# EAGLE design inhaler (EAGLE 9.6.2)
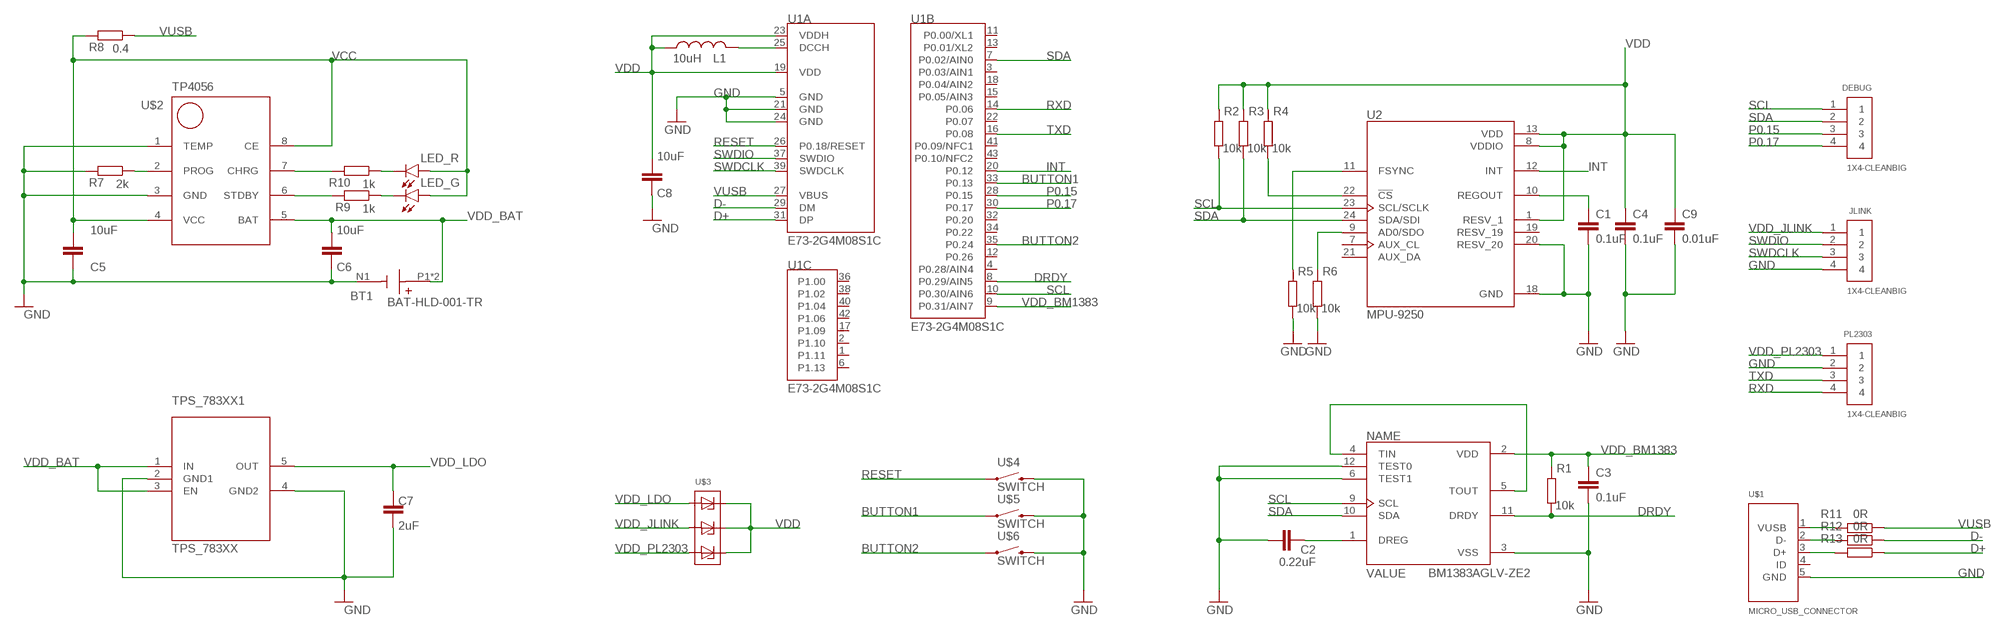
[diagram p0: schematic, sheet 1]

## Parts
BT1  BAT-HLD-001-TR  [BAT_BAT-HLD-001-TR]
C1  0.1uF  C-EUC0805  [C0805]
C2  0.22uF  C-EUC0805  [C0805]
C3  0.1uF  C-EUC0805  [C0805]
C4  0.1uF  C-EUC0805  [C0805]
C5  10uF  C-EUC0805  [C0805]
C6  10uF  C-EUC0805  [C0805]
C7  2uF  C-EUC0805  [C0805]
C8  10uF  C-EUC0805  [C0805]
C9  0.01uF  C-EUC0805  [C0805]
DEBUG  1X4-CLEANBIG  [1X04-CLEANBIG]
JLINK  1X4-CLEANBIG  [1X04-CLEANBIG]
L1  10uH  L-USL0805  [L0805]
LED_G  LEDSMT1206  [1206]
LED_R  LEDSMT1206  [1206]
PL2303  1X4-CLEANBIG  [1X04-CLEANBIG]
R1  10k  R-EU_R0805  [R0805]
R2  10k  R-EU_R0805  [R0805]
R3  10k  R-EU_R0805  [R0805]
R4  10k  R-EU_R0805  [R0805]
R5  10k  R-EU_R0805  [R0805]
R6  10k  R-EU_R0805  [R0805]
R7  2k  R-EU_R0805  [R0805]
R8  0.4  R-EU_R0805  [R0805]
R9  1k  R-EU_R0805  [R0805]
R10  1k  R-EU_R0805  [R0805]
R11  0R  R-EU_R0805  [R0805]
R12  0R  R-EU_R0805  [R0805]
R13  0R  R-EU_R0805  [R0805]
TPS_783XX1  TPS_783XX  [SOT65P280X145-5N]
U1  E73-2G4M08S1C  [E73-2G4M08S1C]
U2  MPU-9250  [QFN40P300X300X105-24N]
U3  BM1383AGLV-ZE2  [PQFN55P250X250X100-12N]
U$1  MICRO_USB_CONNECTOR  [MICRO_USB_4LEGS]
U$2  TP4056  [SOP8]
U$3  SD103ATW  [SOT363]
U$4  SWITCH  [SWITCH_2PIN]
U$5  SWITCH  [SWITCH_2PIN]
U$6  SWITCH  [SWITCH_2PIN]

## Nets
BUTTON1: U1.33(B:P0.13) U$5.1
BUTTON2: U1.35(B:P0.24) U$6.1
D+: R13.1 U1.31(A:DP)
D-: R12.1 U1.29(A:DM)
DRDY: R1.1 U1.8(B:P0.29/AIN5) U3.11(DRDY)
GND: BT1.N1(-) C1.2 C2.1 C3.2 C4.2 C5.1 C6.1 C7.1 C8.1 C9.2 JLINK.4 PL2303.2 R5.1 R6.1 R7.2 TPS_783XX1.2(GND1) TPS_783XX1.4(GND2) U1.5(A:GND) U1.21(A:GND) U1.24(A:GND) U2.18(GND) U2.20(RESV_20) U3.3(VSS) U3.6(TEST1) U3.12(TEST0) U$1.5(GND) U$2.1(TEMP) U$2.3(GND) U$4.2 U$5.2 U$6.2
INT: U1.20(B:P0.12) U2.12(INT)
N$1: C1.1 U2.10(REGOUT)
N$2: U3.4(TIN) U3.5(TOUT)
N$3: C2.2 U3.1(DREG)
N$4: R4.1 U2.22(!CS)
N$5: R5.2 U2.11(FSYNC)
N$6: R7.1 U$2.2(PROG)
N$7: R6.2 U2.9(AD0/SDO)
N$8: R10.2 U$2.7(CHRG)
N$9: L1.2 U1.25(A:DCCH)
N$10: R9.2 U$2.6(STDBY)
N$11: LED_R.C R10.1
N$12: LED_G.C R9.1
N$13: R13.2 U$1.3(D+)
N$14: R11.2 U$1.1(VUSB)
N$15: R12.2 U$1.2(D-)
P0.15: DEBUG.3 U1.28(B:P0.15)
P0.17: DEBUG.4 U1.30(B:P0.17)
RESET: U1.26(A:P0.18/RESET) U$4.1
RXD: PL2303.4 U1.14(B:P0.06)
SCL: DEBUG.1 R2.1 U1.10(B:P0.30/AIN6) U2.23(SCL/SCLK) U3.9(SCL)
SDA: DEBUG.2 R3.1 U1.7(B:P0.02/AIN0) U2.24(SDA/SDI) U3.10(SDA)
SWDCLK: JLINK.3 U1.39(A:SWDCLK)
SWDIO: JLINK.2 U1.37(A:SWDIO)
TXD: PL2303.3 U1.16(B:P0.08)
VCC: C5.2 LED_G.A LED_R.A R8.2 U$2.4(VCC) U$2.8(CE)
VDD: C4.1 C8.2 C9.1 L1.1 R2.2 R3.2 R4.2 U1.19(A:VDD) U1.23(A:VDDH) U2.1(RESV_1) U2.8(VDDIO) U2.13(VDD) U$3.2 U$3.4 U$3.6
VDD_BAT: BT1.P1(+) BT1.P2(+) C6.2 TPS_783XX1.1(IN) TPS_783XX1.3(EN) U$2.5(BAT)
VDD_BM1383: C3.1 R1.2 U1.9(B:P0.31/AIN7) U3.2(VDD)
VDD_JLINK: JLINK.1 U$3.3
VDD_LDO: C7.2 TPS_783XX1.5(OUT) U$3.1
VDD_PL2303: PL2303.1 U$3.5
VUSB: R8.1 R11.1 U1.27(A:VBUS)
Unconnected: U1.1(C:P1.11) U1.2(C:P1.10) U1.3(B:P0.03/AIN1) U1.4(B:P0.28/AIN4) U1.6(C:P1.13) U1.11(B:P0.00/XL1) U1.12(B:P0.26) U1.13(B:P0.01/XL2) U1.15(B:P0.05/AIN3) U1.17(C:P1.09) U1.18(B:P0.04/AIN2) U1.22(B:P0.07) U1.32(B:P0.20) U1.34(B:P0.22) U1.36(C:P1.00) U1.38(C:P1.02) U1.40(C:P1.04) U1.41(B:P0.09/NFC1) U1.42(C:P1.06) U1.43(B:P0.10/NFC2) U2.7(AUX_CL) U2.19(RESV_19) U2.21(AUX_DA) U$1.4(ID)

## Library data of the parts
BT1 = BAT-HLD-001-TR:BAT-HLD-001-TR: Battery Retainer Coin, 20.0mm 1 Cell SMD (SMT) Tab Check availability <https://pricing.snapeda.com/parts/BAT-HLD-001-TR/Linx/view-part?ref=eda>; AVAILABILITY: In Stock; DESCRIPTION: Battery Retainer Coin, 20.0mm 1 Cell SMD (SMT) Tab; MF: Linx; MP: BAT-HLD-001-TR; PACKAGE: None; PRICE: None; PURCHASE-URL: https://pricing.snapeda.com/search/part/BAT-HLD-001-TR/?ref=eda
C1-C9 = rcl:C-EU: CAPACITOR, European symbol; SPICEPREFIX: C
DEBUG JLINK PL2303 = adafruit:1X4: 4-pin connector
L1 = rcl-2:L-US: INDUCTOR, American symbol
LED_G LED_R = led:LED: LED OSRAM: - CHIPLED LG R971, LG N971, LY N971, LG Q971, LY Q971, LO R971, LY R971 LH N974, LH R974 LS Q976, LO Q976, LY Q976 LO Q996 - Hyper CHIPLED LW Q18S LB Q993, LB Q99A, LB R99A - SideLED LS A670, LO A670, LY A670, LG A670, LP A670 LB A673, LV A673, LT A673, LW A673 LH A674 LY A675 LS A676, LA A676, LO A676, LY A676, LW A676 LS A679, LY A679, LG A679 - Hyper Micro SIDELED® LS Y876, LA Y876, LO Y876, LY Y876 LT Y87S - SmartLED LW L88C, LW L88S LB L89C, LB L89S, LG L890 LS L89K, LO L89K, LY L89K LS L896, LA L896, LO L896, LY L896 - TOPLED LS T670, LO T670, LY T670, LG T670, LP T670 LSG T670, LSP T670, LSY T670, LOP T670, LYG T670 LG T671, LOG T671, LSG T671 LB T673, LV T673, LT T673, LW T673 LH T674 LS T676, LA T676, LO T676, LY T676, LB T676, LH T676, LSB T676, LW T676 LB T67C, LV T67C, LT T67C, LS T67K, LO T67K, LY T67K, LW E67C LS E67B, LA E67B, LO E67B, LY E67B, LB E67C, LV E67C, LT E67C LW T67C LS T679, LY T679, LG T679 LS T770, LO T770, LY T770, LG T770, LP T770 LB T773, LV T773, LT T773, LW T773 LH T774 LS E675, LA E675, LY E675, LS T675 LS T776, LA T776, LO T776, LY T776, LB T776 LHGB T686 LT T68C, LB T68C - Hyper Mini TOPLED® LB M676 - Mini TOPLED Santana® LG M470 LS M47K, LO M47K, LY M47K Source: http://www.osram.convergy.de LUXEON: - LUMILED® LXK2-PW12-R00, LXK2-PW12-S00, LXK2-PW14-U00, LXK2-PW14-V00 LXK2-PM12-R00, LXK2-PM12-S00, LXK2-PM14-U00 LXK2-PE12-Q00, LXK2-PE12-R00, LXK2-PE12-S00, LXK2-PE14-T00, LXK2-PE14-U00 LXK2-PB12-K00, LXK2-PB12-L00, LXK2-PB12-M00, LXK2-PB14-N00, LXK2-PB14-P00, LXK2-PB14-Q00 LXK2-PR12-L00, LXK2-PR12-M00, LXK2-PR14-Q00, LXK2-PR14-R00 LXK2-PD12-Q00, LXK2-PD12-R00, LXK2-PD12-S00 LXK2-PH12-R00, LXK2-PH12-S00 LXK2-PL12-P00, LXK2-PL12-Q00, LXK2-PL12-R00 Source: www.luxeon.com KINGBRIGHT: KA-3528ASYC Source: www.kingbright.com
R1-R13 = rcl:R-EU_: RESISTOR, European symbol; SPICEPREFIX: R
TPS_783XX1 = all_in_one:TPS_783XX
U1 = E73-2G4M08S1C:E73-2G4M08S1C: Check availability <https://pricing.snapeda.com/parts/E73-2G4M08S1C/EBYTE/view-part?ref=eda>; AVAILABILITY: Not in stock; DESCRIPTION: E73 series are wireless Bluetooth modules designed by Chengdu Ebyte which feature small size, low power consumption, built-in PCB antenna and IPX interface; MF: EBYTE; MP: E73-2G4M08S1C; PACKAGE: Package; PRICE: None
U2 = MPU-9250:MPU-9250: Axis=3 Axis Gyro+3 Axis Accel+Compass. Pin For Pin With m Check availability <https://pricing.snapeda.com/parts/MPU-9250/TDK%20InvenSense/view-part?ref=eda>; AVAILABILITY: In Stock; DESCRIPTION: Accelerometer, Gyroscope, Magnetometer, 9 Axis Sensor I²C, SPI Output; MF: TDK InvenSense; MP: MPU-9250; PACKAGE: TFQFN-24 TDK InvenSense; PRICE: None
U3 = BM1383AGLV-ZE2:BM1383AGLV-ZE2: Pressure Sensor 30kPa to 110kPa 12-Pin CLGA T/R Check prices <https://pricing.snapeda.com/parts/BM1383AGLV-ZE2/Rohm/view-part?ref=eda>; AVAILABILITY: Good; DESCRIPTION: 壓力傳感器4.35PSI〜15.95PSI（30kPa〜110kPa）絕對16 b 12-VFLGA; MF: Rohm; MP: BM1383AGLV-ZE2; PACKAGE: VFLGA-12 Rohm; PRICE: None; PURCHASE-URL: https://pricing.snapeda.com/search/part/BM1383AGLV-ZE2/?ref=eda
U$1 = all_in_one:MICRO_USB_CONNECTOR
U$2 = all_in_one:TP4056
U$3 = all_in_one:SD103ATW
U$4-U$6 = all_in_one:SWITCH

## Net classes
0 default: clearance 0.205 mm

## Board
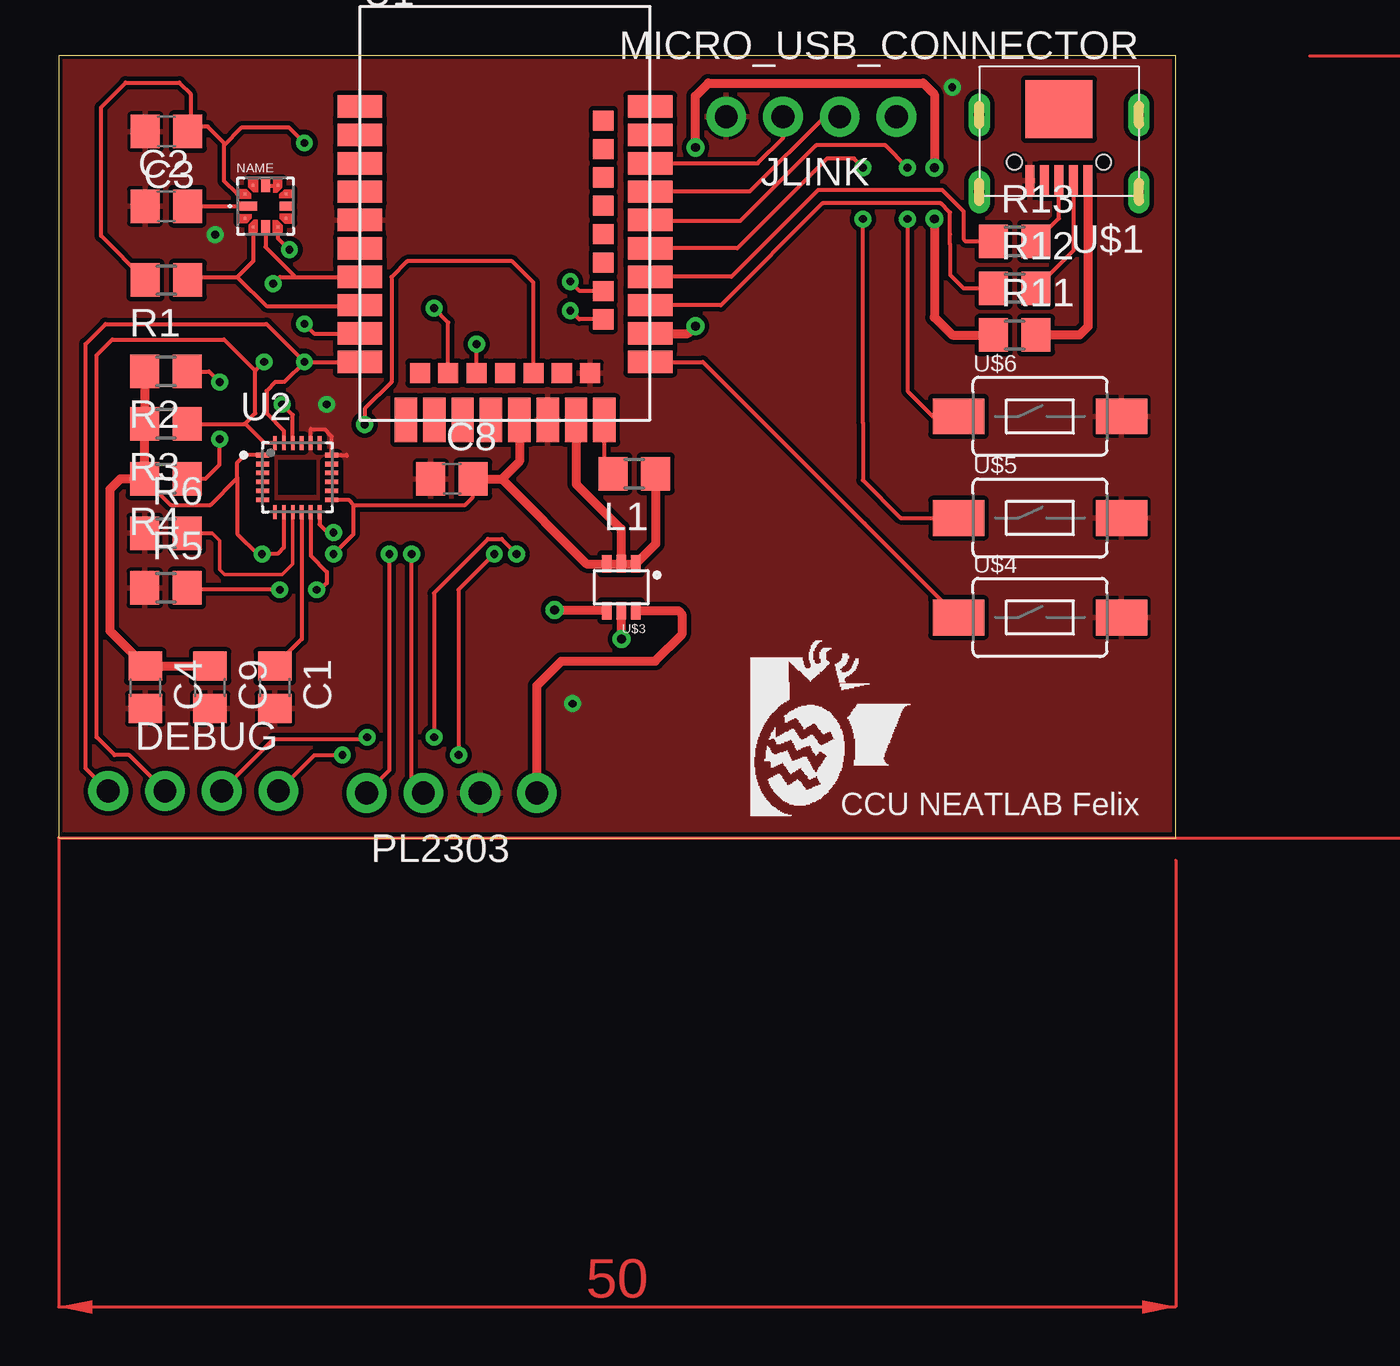
[diagram p1: board, top side]
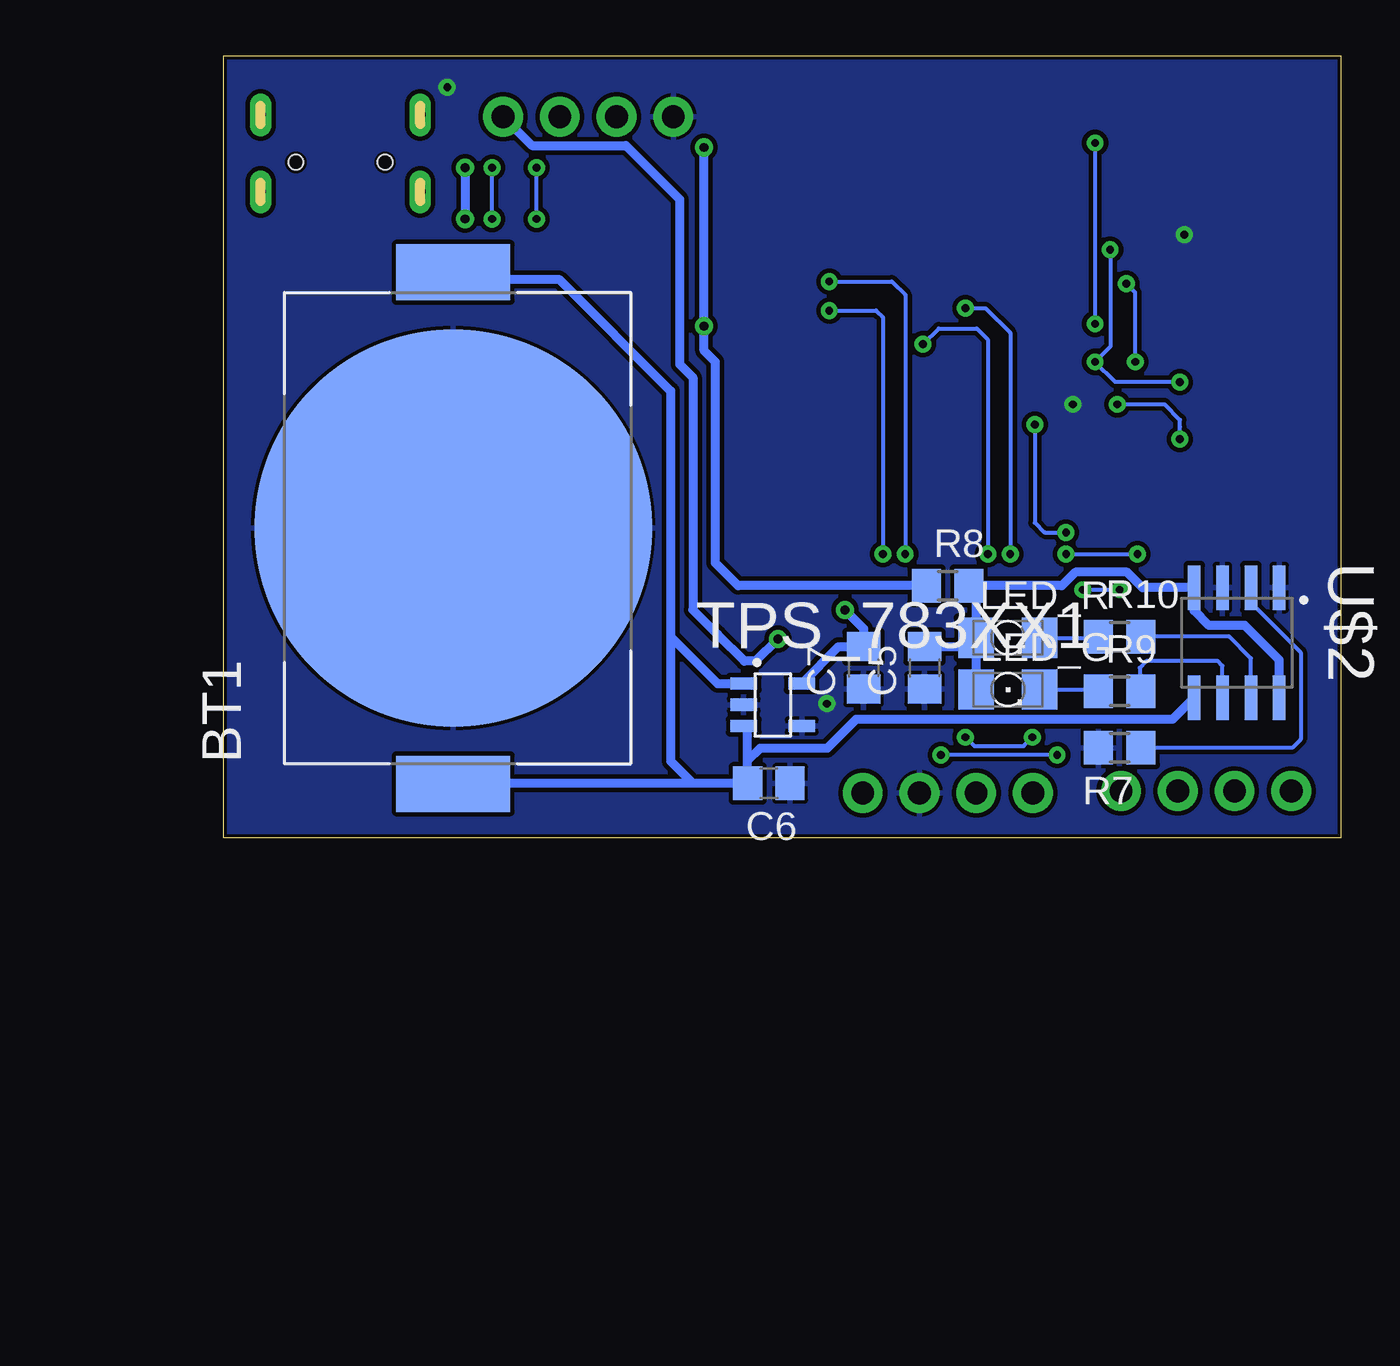
[diagram p2: board, bottom side, seen from below]

Size 50 x 35 mm. Coordinates in mm from the lower left corner, seen from the top.
Outline: 0,0 50,0 50,35 0,35 0,0
Copper layers (1*16): Top 0.035mm / dielectric 1.5mm / Bottom 0.035mm
Design rules "default1": minimum track width 6mil, minimum drill 0.3mm, track to track 6mil, track to pad 6mil, pad to pad 6mil, via to via 6mil, smd to smd 6mil, copper to edge 6mil, drill to drill 6mil, minimum pad ring 10mil, minimum via ring 8mil, stop-mask expansion 4mil, vias tented up to drill 0mil, thermal gap 6mil

### Footprints (pad centres in the part's own frame; a part is rotated, then mirrored left to right if it is on the bottom)
BAT_BAT-HLD-001-TR = smd 17.8 x 17.8: N1 0,0 | smd 2.5 x 5.1: P1 -11.45,0; P2 11.45,0
C0805 = smd 1.3 x 1.5: 1 -0.95,0; 2 0.95,0
1X04-CLEANBIG = drill 1.016 pad 1.778: 1 -3.81,0; 2 -1.27,0; 3 1.27,0; 4 3.81,0
L0805 = smd 1.3 x 1.5: 1 -0.95,0; 2 0.95,0
1206 = smd 1.6 x 1.803: A -1.422,0; C 1.422,0
R0805 = smd 1.3 x 1.5: 1 -0.95,0; 2 0.95,0
SOT65P280X145-5N = smd 1.2 x 0.55: 1 -1.3,0.95; 2 -1.3,0; 3 -1.3,-0.95; 4 1.3,-0.95; 5 1.3,0.95
E73-2G4M08S1C = smd 2 x 1: 1 -6.5,5.03; 2 -6.5,3.76; 3 -6.5,2.49; 4 -6.5,1.22; 5 -6.5,-0.05; 6 -6.5,-1.32; 7 -6.5,-2.59; 8 -6.5,-3.86; 9 -6.5,-5.13; 10 -6.5,-6.4; 26 6.5,-6.4; 27 6.5,-5.13; 29 6.5,-3.86; 31 6.5,-2.59; 33 6.5,-1.32; 35 6.5,-0.05; 37 6.5,1.22; 39 6.5,2.49; 41 6.5,3.76; 43 6.5,5.03 | smd 1 x 2: 11 -4.44,-9; 13 -3.17,-9; 15 -1.9,-9; 17 -0.63,-9; 19 0.64,-9; 21 1.91,-9; 23 3.18,-9; 25 4.45,-9 | smd 0.9 x 0.9: 12 -3.81,-6.9; 14 -2.54,-6.9; 16 -1.27,-6.9; 18 0,-6.9; 20 1.27,-6.9; 22 2.54,-6.9; 24 3.81,-6.9; 28 4.4,-4.495; 30 4.4,-3.225; 32 4.4,-1.955; 34 4.4,-0.685; 36 4.4,0.585; 38 4.4,1.855; 40 4.4,3.125; 42 4.4,4.395
QFN40P300X300X105-24N = smd 0.64 x 0.22: 1 -1.545,1; 2 -1.545,0.6; 3 -1.545,0.2; 4 -1.545,-0.2; 5 -1.545,-0.6; 6 -1.545,-1; 13 1.545,-1; 14 1.545,-0.6; 15 1.545,-0.2; 16 1.545,0.2; 17 1.545,0.6; 18 1.545,1 | smd 0.22 x 0.64: 7 -1,-1.545; 8 -0.6,-1.545; 9 -0.2,-1.545; 10 0.2,-1.545; 11 0.6,-1.545; 12 1,-1.545; 19 1,1.545; 20 0.6,1.545; 21 0.2,1.545; 22 -0.2,1.545; 23 -0.6,1.545; 24 -1,1.545
PQFN55P250X250X100-12N = smd 0.83 x 0.4: 1 -0.8,0 | smd 0.1 x 0.1: 2 -0.925,0.55; 3 -0.55,0.925; 5 0.55,0.925; 6 0.925,0.55; 8 0.925,-0.55; 9 0.55,-0.925; 11 -0.55,-0.925; 12 -0.925,-0.55 | smd 0.4 x 0.58: 4 0,0.925; 10 0,-0.925 | smd 0.58 x 0.4: 7 0.925,0
MICRO_USB_4LEGS = smd 0.4 x 1.4: 1 -1.3,-0.7; 2 -0.65,-0.7; 3 0,-0.7; 4 0.65,-0.7; 5 1.3,-0.7 | smd 3 x 2.6: 6 0,-3.9 | drill 0.45 long: P$1 3.575,-0.2; P$2 3.575,-3.65; P$3 -3.575,-3.65; P$4 -3.575,-0.2 | hole 0.65: -2,-1.525; 2,-1.525
SOP8 = smd 1.981 x 0.559: 1 -2.464,1.905; 2 -2.464,0.635; 3 -2.464,-0.635; 4 -2.464,-1.905; 5 2.464,-1.905; 6 2.464,-0.635; 7 2.464,0.635; 8 2.464,1.905
SOT363 = smd 0.42 x 0.8: 1 0.65,2; 2 0.65,-0.1; 3 0,2; 4 0,-0.1; 5 -0.65,2; 6 -0.65,-0.1
SWITCH_2PIN = smd 2.3 x 1.6: 1 -3.65,0; 2 3.65,0

### Placement (x,y rotation side)
BT1  39.73,13.86 90 bottom
C1  9.67,6.73 270 top
C2  4.82,28.27 0 top
C3  4.83,31.61 180 top
C4  3.88,6.73 270 top
C5  18.63,7.6 90 bottom
C6  25.6,2.43 180 bottom
C7  21.36,7.6 90 bottom
C8  17.6,16.06 0 top
C9  6.78,6.73 270 top
DEBUG  6.03,2.09 0 top
JLINK  33.69,32.28 180 top
L1  25.77,16.29 180 top
LED_G  14.9,6.63 0 bottom
LED_R  14.9,8.95 0 bottom
PL2303  17.59,2 180 top
R1  4.83,24.96 180 top
R2  4.8,20.87 180 top
R3  4.8,18.52 180 top
R4  4.8,16.07 180 top
R5  4.8,11.18 0 top
R6  4.8,13.63 0 top
R7  9.9,4.02 180 bottom
R8  17.6,11.28 0 bottom
R9  9.9,6.55 0 bottom
R10  9.9,9 0 bottom
R11  42.8,22.5 0 top
R12  42.8,24.6 0 top
R13  42.8,26.7 0 top
TPS_783XX1  25.43,5.95 0 bottom
U1  19.98,27.7 0 top
U2  10.68,16.13 0 top
U3  9.26,28.27 0 top
U$1  44.78,28.71 180 top
U$2  4.66,8.73 270 bottom
U$3  25.18,12.16 180 top
U$4  43.93,9.86 0 top
U$5  43.93,14.31 0 top
U$6  43.93,18.86 0 top
U$7  [LOGO_SCALE_1.9]  31,-2 0 top

### Tracks (layer width: path | path; a pad name or v marks a point on that pad's centre or on a via)
BUTTON1  (via drill 0.35 pad 0.71)
  Top 0.18: v36,27.7 36,19 36,18.59 36,16 37.69,14.31 U$5.1 | v36,30 35.6,30.4 34.4,30.4 30.38,26.38 U1.33
  Bottom 0.18: v36,27.7 v36,30
BUTTON2  (via drill 0.35 pad 0.71)
  Top 0.18: v38,27.7 38,20 39.14,18.86 U$6.1 | v38,30 37,31 33.9,31 30.5,27.6 26.53,27.6 U1.35
  Bottom 0.18: v38,27.7 v38,30
D+
  Top 0.18: U1.31 30.11,25.11 34,29 39.54,29 40.5,28.04 40.5,26.8 40.6,26.7 R13.1
D-
  Top 0.18: U1.29 29.64,23.84 34.2,28.4 39.49,28.4 39.9,27.99 39.9,27 39.9,26.55 39.9,25.2 40.5,24.6 R12.1
DRDY
  Top 0.18: U1.8 13.44,23.8 9.3,23.8 8,25.1 | 8,25.1 8.71,25.81 U3.11 | R1.1 5.92,25.1 8,25.1
GND  (via drill 0.35, 0.35 pad 0.71)
  Top 0.18: U2.20 11.28,18.28 11.3,18.3 11.31,18.29 11.9,18.29 12.22,17.96 U2.18 12.87,17.13 12.9,17.1
  other vias: 40,33.6 12,19.4 7,27 23,6
  pour Top: -2,35 -2,0 0,-2 51,-2 52,-1 52,35 52,37 50,39 0,39 -2,37
  pour Bottom: -2,35 -2,0 0,-2 50,-2 52,0 52,36 50,38 0,38 -2,36
INT  (via drill 0.35 pad 0.71)
  Top 0.18: v13.7,18.5 13.7,19.2 14.9,20.4 14.9,25.1 15.6,25.8 20.3,25.8 21.25,24.85 U1.20 | U2.12 11.68,14.02 12.04,13.66 v12.3,13.66
  Bottom 0.18: v13.7,18.5 13.7,14.1 13.26,13.66 v12.3,13.66
N$1
  Top 0.18: C1.1 10.88,8.89 U2.10
N$2
  Top 0.18: U3.4 U3.5
N$3
  Top 0.18: C2.2 U3.1
N$4  (via drill 0.35 pad 0.71)
  Top 0.18: R4.1 6.57,16.07 7.2,16.7 v7.2,17.85 | U2.22 10.48,18.92 v10,19.4
  Bottom 0.18: v7.2,17.85 7.2,18 7.2,18.4 7.2,18.7 7.9,19.4 v10,19.4
N$5  (via drill 0.35 pad 0.71)
  Top 0.18: R5.2 6.1,11.18 6.18,11.1 v9.9,11.1 | v11.55,11.1 11.7,11.1 12,11.4 12,11.9 11.28,12.62 U2.11
  Bottom 0.18: v11.55,11.1 v9.9,11.1
N$6
  Bottom 0.18: U$2.2 4.03,10.53 1.8,8.3 1.8,4.4 2.18,4.02 R7.1
N$7
  Top 0.152: U2.9 10.48,12.25 10,11.77 7.43,11.77 7.2,12 7.2,13.3 6.87,13.63
  Top 0.18: R6.2 6.87,13.63
N$8
  Bottom 0.18: U$2.7 4.03,8.03 5,9 R10.2
N$9
  Top 0.18: L1.2 24.43,16.68 U1.25
N$10
  Bottom 0.18: U$2.6 5.29,7.7 5.5,7.9 8.7,7.9 9,7.6 9,6.6 R9.2
N$11
  Bottom 0.18: LED_R.C 10.9,8.95 R10.1
N$12
  Bottom 0.18: LED_G.C 10.93,6.63 R9.1
N$13
  Top 0.18: R13.2 44.78,27.73 U$1.3
N$14
  Top 0.406: R11.2 45.7,22.5 46.08,22.88 U$1.1
N$15
  Top 0.18: U$1.2 45.43,26.28 R12.2
P0.15  (via drill 0.35 pad 0.71)
  Top 0.18: v13.8,4.5 13.7,4.4 9.61,4.4 DEBUG.3 | U1.28 23.3,23.2 v22.9,23.6 | v16.8,4.5 16.8,10.95 19.22,13.37 19.83,13.37 v20.5,12.7
  Bottom 0.18: v16.8,4.5 16.4,4.1 14.2,4.1 v13.8,4.5 | v22.9,23.6 20.8,23.6 20.5,23.3 v20.5,12.7
P0.17  (via drill 0.35 pad 0.71)
  Top 0.18: DEBUG.4 11.45,3.7 v12.7,3.7 | U1.30 23.32,24.48 v22.9,24.9 | v19.5,12.7 17.9,11.1 v17.9,3.7
  Bottom 0.18: v12.7,3.7 v17.9,3.7 | v22.9,24.9 20.1,24.9 19.5,24.3 v19.5,12.7
RESET
  Top 0.18: U$4.1 36.07,14.07 36,14.14 28.84,21.3 U1.26
RXD  (via drill 0.35 pad 0.71)
  Top 0.18: U1.14 17.44,23.06 v16.8,23.7 | v14.8,12.7 14.8,3.02 PL2303.4
  Bottom 0.18: v16.8,23.7 15.9,23.7 14.8,22.6 v14.8,12.7
SCL  (via drill 0.35 pad 0.71)
  Top 0.18: U3.9 9.81,26.84 v10.33,26.32 | v11,21.3 U1.10 | U2.23 10.08,18.22 9.3,19 9.3,20 9.7,20.4 10.1,20.4 v11,21.3 | DEBUG.1 1.2,3.11 1.2,22.1 2.1,23 9.3,23 v11,21.3 | R2.1 6.73,20.87 v7.2,20.4
  Bottom 0.18: v10.33,26.32 10.33,21.97 v11,21.3 10.1,20.4 v7.2,20.4
SDA  (via drill 0.35 pad 0.71)
  Top 0.18: U3.10 9.26,26.44 10.6,25.1 | 10.6,25.1 U1.7 | DEBUG.2 3.15,3.7 2.5,3.7 1.7,4.5 1.7,21.6 2.4,22.3 7.4,22.3 8.8,20.9 | v9.6,24.8 9.9,25.1 10.6,25.1 | U2.24 9.23,17.67 8.38,18.52 8.32,18.52 | R3.1 8.32,18.52 | 8.32,18.52 8.8,19 8.8,20.9 | 8.8,20.9 v9.2,21.3
  Bottom 0.18: v9.2,21.3 9.2,24.4 v9.6,24.8
SWDCLK
  Top 0.18: U1.39 31.29,30.19 32.42,31.32 JLINK.3
SWDIO
  Top 0.18: JLINK.2 34.29,32.28 30.93,28.92 U1.37
TXD  (via drill 0.35 pad 0.71)
  Top 0.18: U1.16 v18.71,22.09 v18.7,22.1 | PL2303.3 15.8,2.52 v15.8,12.7
  Bottom 0.18: v18.7,22.1 18,22.8 16.3,22.8 15.8,22.3 v15.8,12.7
VCC
  Bottom 0.406: LED_G.A LED_R.A | C5.2 16.72,8.55 LED_R.A | LED_R.A 16.32,10.95 R8.2
  Bottom 0.41: R8.2 12.49,11.28 11.88,11.89 9.57,11.89 8.88,11.19 U$2.4 6.57,10.16 5.9,9.5 4.3,9.5 2.75,7.96 U$2.8
VDD  (via drill 0.35 pad 0.71)
  Top 0.18: U2.1 8.33,17.13 8,16.8 8,16.1 | U2.13 12.97,15.13 13.2,14.9 | 13.2,14.9 13.2,13.6 v12.3,12.7 | 8,16.1 8,13.6 8.9,12.7 v9.1,12.7 9.8,12.7 10.08,12.98 U2.8 | R4.2 5.02,14.9 6.8,14.9 8,16.1 | 13.2,14.9 18.2,14.9 18.55,15.25 C8.2
  Top 0.406: L1.1 26.72,13.15 U$3.6 U$3.4 | U1.23 23.16,15.84 25.18,13.82 U$3.4 | 19.84,16.06 23.64,12.26 U$3.2 U$3.4 | C8.2 19.84,16.06 | U1.19 20.62,16.84 19.84,16.06 | R2.2 R3.2 R4.2 2.77,16.07 2.3,15.6 2.3,9.26 C4.1 C9.1
  Bottom 0.18: v12.3,12.7 v9.1,12.7
VDD_BAT
  Bottom 0.406: C6.2 29,2.43 | 29,2.43 39.71,2.43 BT1.P1 | BT1.P2 39.42,25 35,25 30,20 30,9 | 30,9 27.9,6.9 TPS_783XX1.1 | 30,9 30,3.43 29,2.43
  Bottom 0.41: U$2.5 7.53,5.3 21.7,5.3 23,4 26,4 26.55,3.45 | C6.2 26.55,3.45 | 26.55,3.45 26.55,4.82 TPS_783XX1.3
VDD_BM1383  (via drill 0.35 pad 0.71)
  Top 0.18: R1.2 1.9,26.94 1.9,32.7 3,33.8 5.4,33.8 5.9,33.3 5.9,31.73 C3.1 | U3.2 7.98,28.82 7.4,29.4 7.4,31 | 6,31.83 6.67,31.83 7.4,31.1 7.4,31 | 7.4,31 8.2,31.8 10.3,31.8 v11,31.1 | v11,23 11.43,22.57 U1.9
  Top 0.406: 6,31.83 C3.1
  Bottom 0.18: v11,31.1 v11,23
VDD_JLINK  (via drill 0.4 pad 0.81)
  Top 0.406: U$3.3 25.18,8.92 v25.2,8.9
  Bottom 0.406: JLINK.1 36.2,30.98 32,30.98 29.6,28.58 29.6,21.2 29,20.6 29,10.2 27.9,9.1 26.7,7.9 26.2,7.9 v25.2,8.9
VDD_LDO  (via drill 0.4 pad 0.81)
  Top 0.406: v22.2,10.2 24.49,10.2 U$3.1
  Bottom 0.406: v22.2,10.2 21.41,9.4
  Bottom 0.41: 21.41,9.4 21.36,9.36 C7.2 22.48,8.55 TPS_783XX1.5
VDD_PL2303
  Top 0.406: PL2303.1 21.4,6.8 22.5,7.9 26.7,7.9 27.9,9.1 27.9,10 27.74,10.16 U$3.5
VUSB  (via drill 0.4 pad 0.81)
  Top 0.406: U1.27 28.17,22.57 v28.5,22.9 | v28.5,30.9 28.5,33.2 29.08,33.78 38.7,33.78 39.2,33.28 v39.2,30 | R11.1 40,22.5 39.2,23.3 v39.2,27.7
  Bottom 0.406: v28.5,30.9 v28.5,22.9 28.5,21.8 28,21.3 28,12.3 26.98,11.28 R8.1 | v39.2,30 v39.2,27.7
(copper drawn outside any net)
  shapes: Top area x2

### Text on the board
tPlace: CCU NEATLAB Felix